# Altium schematic sheet ArduinoUnoShield.SchDoc
size A4
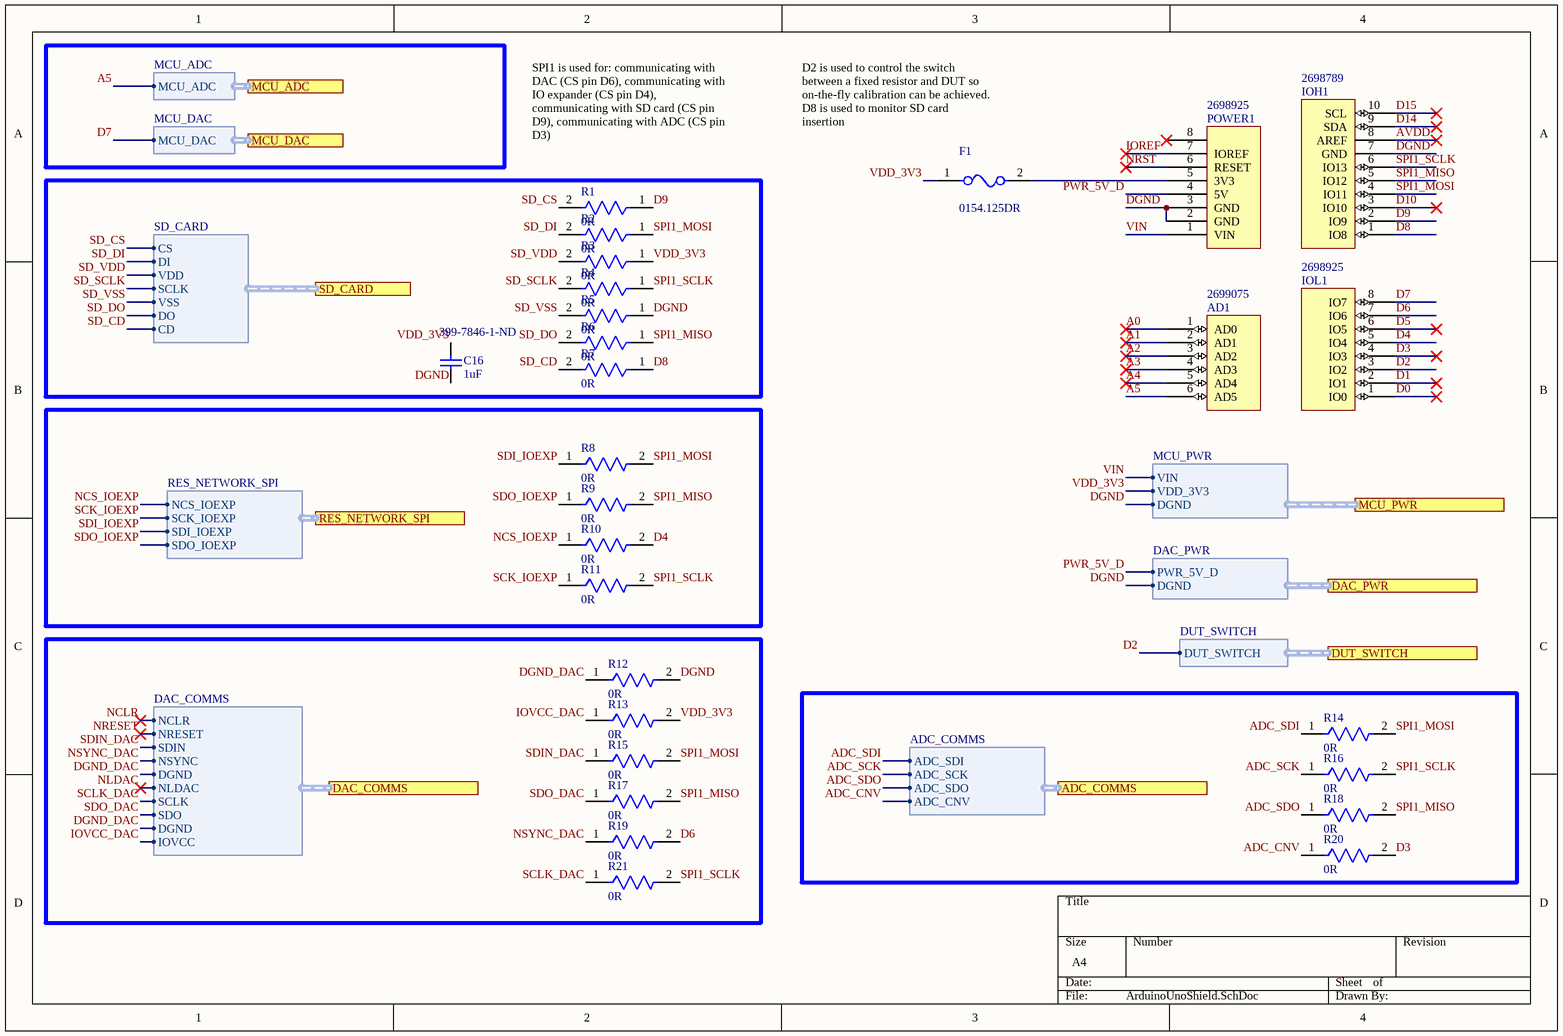
[diagram p0: ArduinoUnoShield.SchDoc]

## Parts
AD1  Supplier Part Number 4: 2699075  [Header 6x1 8.5mm]  (hidden comment: AD)
C16  1uF  Supplier Part Number 1: 399-7846-1-ND  [CAPC1608X95X35LL15T15]
F1  0154.125DR  [FP-0154-MFG]
IOH1  Supplier Part Number 3: 2698789  [Header 10x1 8.5mm]  (hidden comment: IOH)
IOL1  Supplier Part Number 4: 2698925  [Header 8x1 8.5mm]  (hidden comment: IOL)
POWER1  Supplier Part Number 4: 2698925  [Header 8x1 8.5mm]  (hidden comment: POWER_UNO)
R1  0R  [FP-CR0603-MFG]
R2  0R  [FP-CR0603-MFG]
R3  0R  [FP-CR0603-MFG]
R4  0R  [FP-CR0603-MFG]
R5  0R  [FP-CR0603-MFG]
R6  0R  [FP-CR0603-MFG]
R7  0R  [FP-CR0603-MFG]
R8  0R  [FP-CR0603-MFG]
R9  0R  [FP-CR0603-MFG]
R10  0R  [FP-CR0603-MFG]
R11  0R  [FP-CR0603-MFG]
R12  0R  [FP-CR0603-MFG]
R13  0R  [FP-CR0603-MFG]
R14  0R  [FP-CR0603-MFG]
R15  0R  [FP-CR0603-MFG]
R16  0R  [FP-CR0603-MFG]
R17  0R  [FP-CR0603-MFG]
R18  0R  [FP-CR0603-MFG]
R19  0R  [FP-CR0603-MFG]
R20  0R  [FP-CR0603-MFG]
R21  0R  [FP-CR0603-MFG]

## Ports
ADC_COMMS (harness ADC_COMMS), DAC_COMMS (harness DAC_COMMS), DAC_PWR (harness DAC_PWR), DUT_SWITCH (harness DUT_SWITCH), MCU_ADC (harness MCU_ADC), MCU_DAC (harness MCU_DAC), MCU_PWR (harness MCU_PWR), RES_NETWORK_SPI (harness RES_NETWORK_SPI), SD_CARD (harness SD_CARD)

## Harnesses
SD_CARD: CS, DI, VDD, SCLK, VSS, DO, CD
MCU_PWR: VDD_3V3, DGND, VIN
DAC_COMMS: NCLR, NRESET, SDIN, DGND, NSYNC, NLDAC, SDO, SCLK, DGND, IOVCC
RES_NETWORK_SPI: NCS_IOEXP, SCK_IOEXP, SDI_IOEXP, SDO_IOEXP
MCU_DAC: MCU_DAC
MCU_ADC: MCU_ADC
DAC_PWR: DGND, PWR_5V_D
ADC_COMMS: ADC_SCK, ADC_SDO, ADC_SDI, ADC_CNV
DUT_SWITCH: DUT_SWITCH

## Nets
A0: AD1.1(AD0)
A1: AD1.2(AD1)
A2: AD1.3(AD2)
A3: AD1.4(AD3)
A4: AD1.5(AD4)
A5: AD1.6(AD5) ; port MCU_ADC.MCU_ADC
ADC_CNV: R20.1 ; port ADC_COMMS.ADC_CNV
ADC_SCK: R16.1 ; port ADC_COMMS.ADC_SCK
ADC_SDI: R14.1 ; port ADC_COMMS.ADC_SDI
ADC_SDO: R18.1 ; port ADC_COMMS.ADC_SDO
AVDD: IOH1.8(AREF)
D0: IOL1.1(IO0)
D1: IOL1.2(IO1)
D2: IOL1.3(IO2) ; port DUT_SWITCH.DUT_SWITCH
D3: IOL1.4(IO3) R20.2
D4: IOL1.5(IO4) R10.2
D5: IOL1.6(IO5)
D6: IOL1.7(IO6) R19.2
D7: IOL1.8(IO7) ; port MCU_DAC.MCU_DAC
D8: IOH1.1(IO8) R7.1
D9: IOH1.2(IO9) R1.1
D10: IOH1.3(IO10)
D14: IOH1.9(SDA)
D15: IOH1.10(SCL)
DGND: C16.1 IOH1.7(GND) POWER1.2(GND) POWER1.3(GND) R5.1 R12.2 ; port MCU_PWR.DGND, port DAC_PWR.DGND
DGND_DAC: R12.1 ; port DAC_COMMS.DGND
IOREF: POWER1.7(IOREF)
IOVCC_DAC: R13.1 ; port DAC_COMMS.IOVCC
NCLR: port DAC_COMMS.NCLR
NCS_IOEXP: R10.1 ; port RES_NETWORK_SPI.NCS_IOEXP
NLDAC: port DAC_COMMS.NLDAC
NRESET: port DAC_COMMS.NRESET
NRST: POWER1.6(RESET)
NSYNC_DAC: R19.1 ; port DAC_COMMS.NSYNC
PWR_5V_D: POWER1.4(5V) ; port DAC_PWR.PWR_5V_D
SCK_IOEXP: R11.1 ; port RES_NETWORK_SPI.SCK_IOEXP
SCLK_DAC: R21.1 ; port DAC_COMMS.SCLK
SD_CD: R7.2 ; port SD_CARD.CD
SD_CS: R1.2 ; port SD_CARD.CS
SD_DI: R2.2 ; port SD_CARD.DI
SD_DO: R6.2 ; port SD_CARD.DO
SD_SCLK: R4.2 ; port SD_CARD.SCLK
SD_VDD: R3.2 ; port SD_CARD.VDD
SD_VSS: R5.2 ; port SD_CARD.VSS
SDI_IOEXP: R8.1 ; port RES_NETWORK_SPI.SDI_IOEXP
SDIN_DAC: R15.1 ; port DAC_COMMS.SDIN
SDO_DAC: R17.1 ; port DAC_COMMS.SDO
SDO_IOEXP: R9.1 ; port RES_NETWORK_SPI.SDO_IOEXP
SPI1_MISO: IOH1.5(IO12) R6.1 R9.2 R17.2 R18.2
SPI1_MOSI: IOH1.4(IO11) R2.1 R8.2 R14.2 R15.2
SPI1_SCLK: IOH1.6(IO13) R4.1 R11.2 R16.2 R21.2
VDD_3V3: C16.2 F1.1 R3.1 R13.2 ; port MCU_PWR.VDD_3V3
VIN: POWER1.1(VIN) ; port MCU_PWR.VIN
NetF1_2: F1.2 POWER1.5(3V3)

Not connected (* = marked no-connect by the designer): POWER1 8*

## Notes on the sheet
- SPI1 is used for: communicating with DAC (CS pin D6), communicating with IO expander (CS pin D4), communicating with SD card (CS pin D9), communicating with ADC (CS pin D3)
- (near F1) D2 is used to control the switch between a fixed resistor and DUT so on-the-fly calibration can be achieved. D8 is used to monitor SD card insertion

## Library data of the parts
C16 = CMP-2006-02216-1: Manufacturer: Kemet; Part Number: C0603C105K3PACTU; Description: KEMET - C0603C105K3PACTU - SMD Multilayer Ceramic Capacitor, 1 µF, 25 V, 0603 [1608 Metric], ± 10%, X5R, C Series KEMET; Dielectric Material: Ceramic; Tolerance: 10%; Dielectric: X5R; Voltage Rating (DC): 25V; Supplier 1: Digi-Key; Manufacturer Part Number: C0603C105K3PACTU; RoHS: Yes; Category: Ceramic Capacitors; Stock 1: 157618; Pricing 1: 1=0.18000, 10=0.12700, 50=0.07220, 100=0.05980, 500=0.04194, 1000=0.03472 (USD); Mount: Surface Mount; Case/Package: 0603; Contact Plating: Tin,Matte; Min Operating Temperature: -55°C; Max Operating Temperature: 85°C; Capacitance: 1uF; Packaging: Tape and Reel; Voltage: 25V; Termination: SMD/SMT; Length: 1.6mm; Height: 0.8mm; Depth: 0.8mm; Radiation Hardening: No; Lead Free: Lead Free; ComponentLink1URL: https://datasheet.ciiva.com/28610/1918694-28610792.pdf?src-supplier=Element14; ComponentLink1Description: https://datasheet.ciiva.com/28610/1918694-28610792.pdf?src-supplier=Element14; ComponentLink2URL: https://datasheet.ciiva.com/5998/40889-5998745.pdf?src-supplier=Farnell; ComponentLink2Description: https://datasheet.ciiva.com/5998/40889-5998745.pdf?src-supplier=Farnell; Supplier Unit Price 1: 0.18
F1 = CMP-08604-000003-1: FUSE BOARD MNT 125MA 125VAC/VDC; Manufacturer: Littelfuse Inc; Voltage Rating Dc: 125V; Conn Orientation: Horizontal; Number Of Fuses: 1; Fuse Current: 0.125A; Automotive: No; Device Class L1: Circuit Protection; Temperature Range High: +125°C; Category: Fuse; Temperature: -55°C to +125°C; Lead Free: Yes; ComponentLink2Description: Datasheet; RoHS: TRUE; Mouser Description: Fuse Chip Very Fast Acting 0.125A SMD Solder Pad 9.73 X 5.03 X 3.81mm T/R CSA/PSE/UL; Octopart: https://octopart.com/0154.125dr-littelfuse-557957; Height: 3.81mm; Digikey Description: FUSE BOARD MNT 125MA 125VAC/VDC; Temperature Range Low: -55°C; Voltage Rating Ac: 125V; Device Class L3: unset; Package: 0154; Device Class L2: Fuse Holders; Manufacturer Part Number: 0154.125DR; ComponentLink2URL: https://www.littelfuse.com/~/media/electronics/datasheets/fuses/littelfuse_fuse_154_154t_154l_154tl_datasheet.pdf.pdf
R1-R21 = CMP-07231-000023-1: Thick Film Chip Resistors 0603 0Ω 0.1W 5%; Power Rating: 100mW; Resistance: 0mR; Voltage Rating (DC): 50V; Tolerance: 1%; Temperature Coefficient: 500ppm/°C; Depth: 0.8mm; Height: 0.45mm; Case Code (Metric): 1608; Number of Pins: 2; Max Operating Temperature: 155°C; Mount: Surface Mount; REACH SVHC: No SVHC; Radiation Hardening: No; Width: 0.8mm; Max Power Dissipation: 100mW; Thickness: 457um; Package Quantity: 5000; Composition: Thick Film; Case/Package: 0603; Military Standard: Not; Packaging: Tape and Reel; Voltage Rating: 50V; Case Code (Imperial): 0603; Min Operating Temperature: -55°C; Contact Plating: Tin; Length: 1.6mm; Termination: SMD/SMT
AD1 = AD: Supplier 1: Arrow; Supplier Part Number 1: 2699089; Supplier 2: Digi-Key; Supplier Part Number 2: SAM1198-06-ND; Supplier 3: Arrow; Supplier Part Number 3: 2699088; Supplier 4: Arrow
IOH1 = IOH: Supplier 1: Arrow; Supplier Part Number 1: 2698803S4475693N1004; Supplier 2: Digi-Key; Supplier Part Number 2: SAM1198-10-ND; Supplier 3: Arrow
IOL1 = IOL: Supplier 1: Digi-Key; Supplier Part Number 1: SAM1198-08-ND; Supplier 2: Arrow; Supplier Part Number 2: 2698939; Supplier 3: Arrow; Supplier Part Number 3: 2698940; Supplier 4: Arrow
POWER1 = POWER_UNO: Supplier 1: Digi-Key; Supplier Part Number 1: SAM1198-08-ND; Supplier 2: Arrow; Supplier Part Number 2: 2698939; Supplier 3: Arrow; Supplier Part Number 3: 2698940; Supplier 4: Arrow